# EAGLE design with-vreg (EAGLE 6.2)
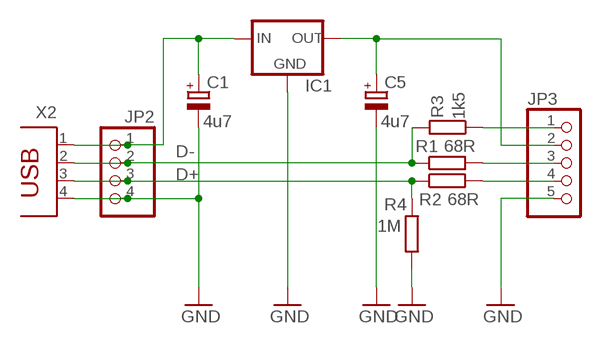
[diagram p0: schematic, sheet 1]

## Parts
C1  4u7  CPOL-EUE2-5  [E2-5]
C5  4u7  CPOL-EUE2-5  [E2-5]
IC1  V_REG_78XXSINK  [TO220-IGO]
JP2  PINHD-1X4  [1X04]
JP3  PINHD-1X5  [1X05]
R1  68R  R-EU_0207/10  [0207/10]
R2  68R  R-EU_0207/10  [0207/10]
R3  1k5  R-EU_0207/10  [0207/10]
R4  1M  R-EU_0207/10  [0207/10]
X2  PN61729  [PN61729]

## Nets
D+: JP2.3 R2.1 R4.2 X2.3
D-: JP2.2 R1.1 R3.2 X2.2
GND: C1.- C5.- IC1.GND JP2.4 JP3.5 R4.1 X2.4
N$1: JP3.3 R1.2
N$2: JP3.4 R2.2
N$3: C1.+ IC1.IN JP2.1 X2.1
N$4: JP3.1 R3.1
VCC: C5.+ IC1.OUT JP3.2

## Library data of the parts
C1 C5 = rcl:CPOL-EU: POLARIZED CAPACITOR, European symbol
IC1 = SparkFun:V_REG_78XX: Voltage Regulator Standard 7805 5V regulator. IGO (Input Ground Output). Spark Fun Electronics SKU : COM-00107
JP2 = pinhead:PINHD-1X4: PIN HEADER
JP3 = pinhead:PINHD-1X5: PIN HEADER
R1-R4 = rcl:R-EU_: RESISTOR, European symbol
X2 = con-berg:PN61729: BERG USB connector

## Board
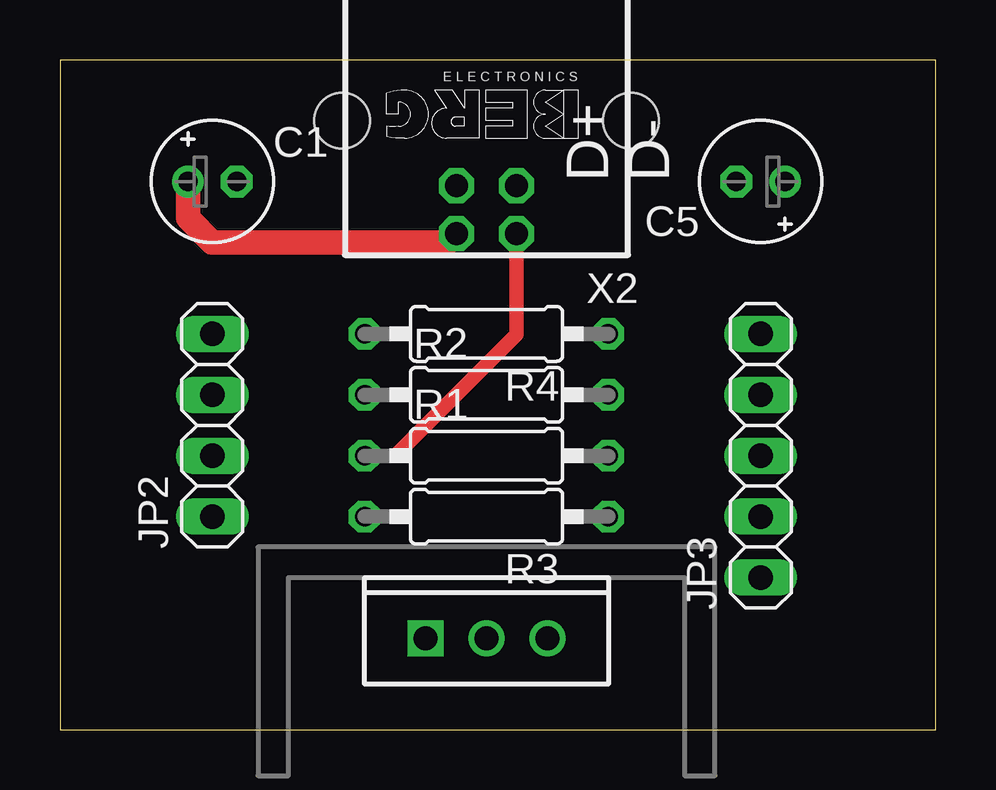
[diagram p1: board, top side]
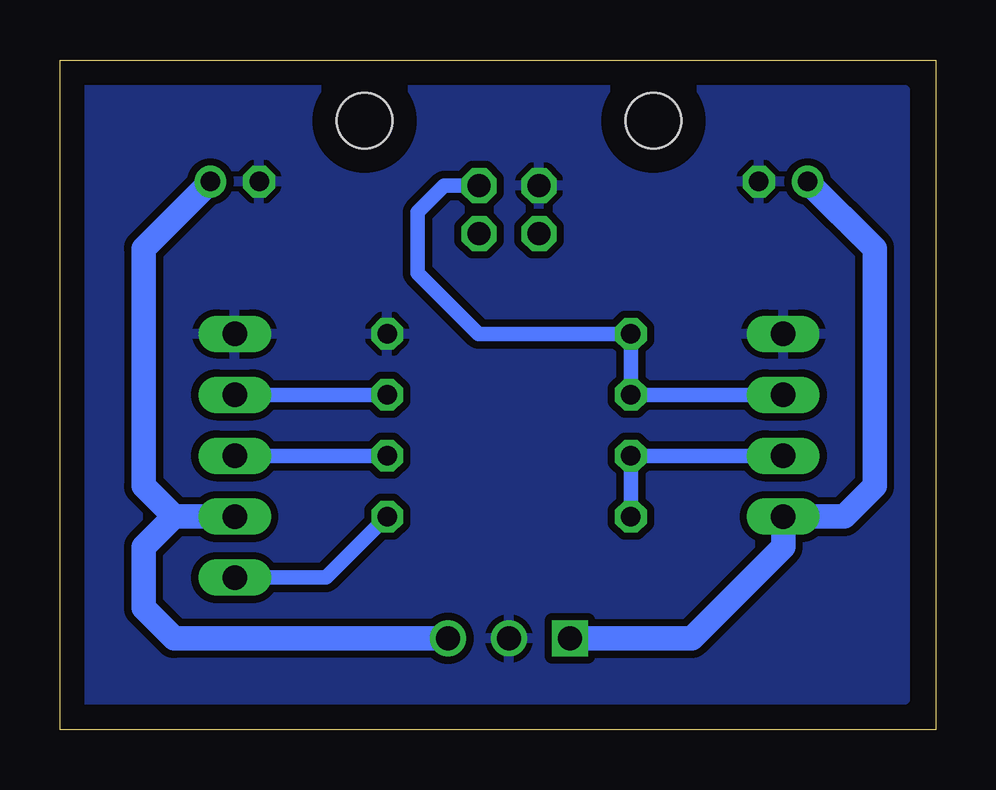
[diagram p2: board, bottom side, seen from below]

Size 36.5 x 27.93 mm. Coordinates in mm from the lower left corner, seen from the top.
Outline: 0,0 36.5,0 36.5,27.93 0,27.93 0,0
Copper layers (1*16): Top 0.035mm / dielectric 1.5mm / Bottom 0.035mm
Design rules: minimum track width 10mil, minimum drill 24mil, track to track 12mil, track to pad 18mil, pad to pad 8mil, via to via 8mil, smd to smd 8mil, copper to edge 40mil, drill to drill 8mil, minimum pad ring 10mil, minimum via ring 8mil, stop-mask expansion 4mil, vias tented up to drill 0mil, thermal gap 10mil

### Footprints (pad centres in the part's own frame; a part is rotated, then mirrored left to right if it is on the bottom)
E2-5 = drill 0.813 pad 1.27: + -1.016,0 | drill 0.813 pad 1.27 octagon: - 1.016,0
TO220-IGO = drill 1: GND 0,0; OUT 2.54,0 | drill 1 square: IN -2.54,0
1X04 = drill 1.016 long: 1 -3.81,0; 2 -1.27,0; 3 1.27,0; 4 3.81,0
1X05 = drill 1.016 long: 1 -5.08,0; 2 -2.54,0; 3 0,0; 4 2.54,0; 5 5.08,0
0207/10 = drill 0.813 octagon: 1 -5.08,0; 2 5.08,0
PN61729 = drill 0.95 octagon: 1 1.25,4.71; 2 -1.25,4.71; 3 -1.25,2.71; 4 1.25,2.71 | hole 2.3: -6.02,0; 6.02,0

### Placement (x,y rotation side)
C1  6.35,22.86 0 top
C5  29.21,22.86 180 top
IC1  17.78,3.81 0 top
JP2  6.35,12.7 90 top
JP3  29.21,11.43 90 top
R1  17.78,11.43 0 top
R2  17.78,13.97 0 top
R3  17.78,8.89 180 top
R4  17.78,16.51 180 top
X2  17.78,25.4 180 top

### Tracks (layer width: path | path; a pad name or v marks a point on that pad's centre or on a via)
D+
  Bottom 0.61: JP2.3 R2.1 R4.2 19.05,16.51 21.59,19.05 21.59,21.59 20.49,22.69 X2.3
D-
  Top 0.61: X2.2 19.03,16.49 13.97,11.43 R1.1
  Bottom 0.61: JP2.2 R1.1 R3.2
GND
  pour Bottom: 1.27,26.67 35.56,26.67 35.56,1.27 1.27,1.27
N$1
  Bottom 0.61: R1.2 JP3.3
N$2
  Bottom 0.61: R2.2 JP3.4
N$3
  Top 1.016: C1.+ 5.33,21.34 6.35,20.32 16.16,20.32 X2.1
  Bottom 1.016: IC1.IN 10.16,3.81 6.35,7.62 JP2.1 3.81,8.89 2.54,10.16 2.54,20.07 C1.+
N$4
  Bottom 0.61: R3.1 25.4,6.35 JP3.1
VCC
  Bottom 1.016: IC1.OUT 31.75,3.81 33.02,5.08 33.02,7.62 31.75,8.89 | 31.75,8.89 JP3.2 | C5.+ 33.02,20.07 33.02,10.16 31.75,8.89

### Text on the board
tNames: D+ | D-
tValues: G | D2 | D4 | V | D5